# EAGLE design dcdc (EAGLE 6.6.0)
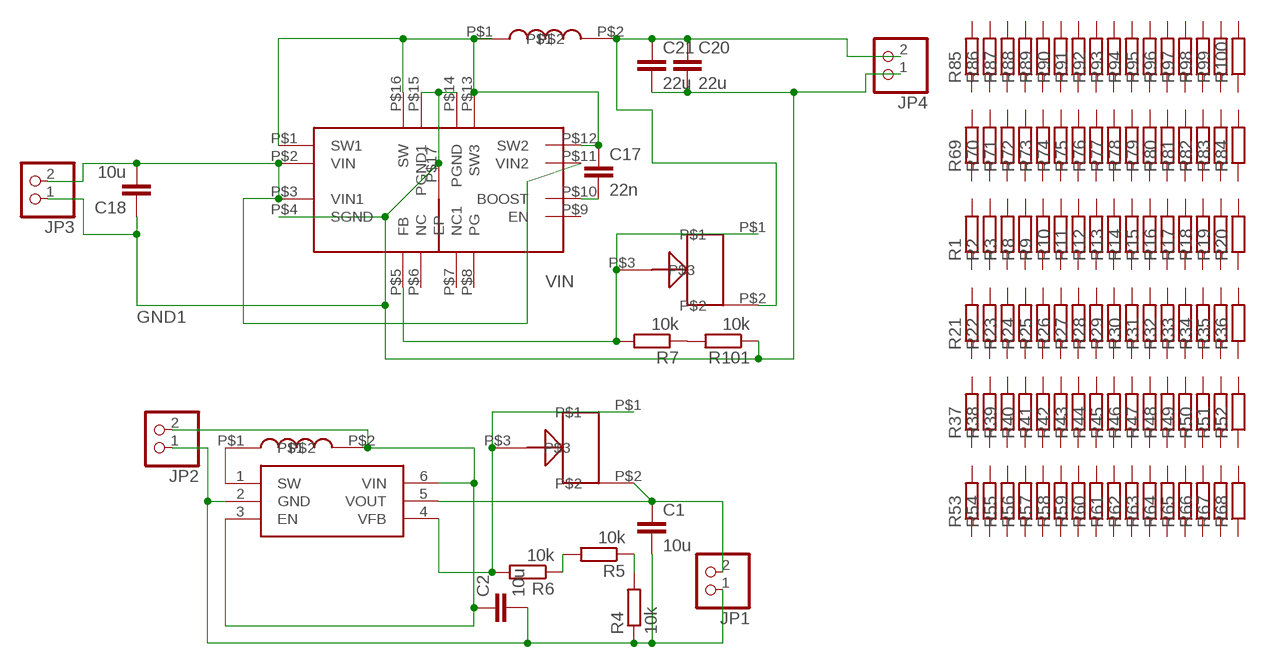
[diagram p0: schematic, sheet 1]

## Parts
C1  10u  C-EUC1206K  [C1206K]
C2  10u  C-EUC1206K  [C1206K]
C17  22n  C-EUC0603  [C0603]
C18  10u  C-EUC1206K  [C1206K]
C20  22u  C-EUC1206K  [C1206K]
C21  22u  C-EUC1206K  [C1206K]
JP1  PINHD-1X2  [1X02]
JP2  PINHD-1X2  [1X02]
JP3  PINHD-1X2  [1X02]
JP4  PINHD-1X2  [1X02]
R1  R-EU_R0402  [R0402]
R2  R-EU_R0402  [R0402]
R3  R-EU_R0402  [R0402]
R4  10k  R-EU_R0603  [R0603]
R5  10k  R-EU_R0603  [R0603]
R6  10k  R-EU_R0603  [R0603]
R7  10k  R-EU_R0603  [R0603]
R8  R-EU_R0402  [R0402]
R9  R-EU_R0402  [R0402]
R10  R-EU_R0402  [R0402]
R11  R-EU_R0402  [R0402]
R12  R-EU_R0402  [R0402]
R13  R-EU_R0402  [R0402]
R14  R-EU_R0402  [R0402]
R15  R-EU_R0402  [R0402]
R16  R-EU_R0402  [R0402]
R17  R-EU_R0402  [R0402]
R18  R-EU_R0402  [R0402]
R19  R-EU_R0402  [R0402]
R20  R-EU_R0402  [R0402]
R21  R-EU_R0402  [R0402]
R22  R-EU_R0402  [R0402]
R23  R-EU_R0402  [R0402]
R24  R-EU_R0402  [R0402]
R25  R-EU_R0402  [R0402]
R26  R-EU_R0402  [R0402]
R27  R-EU_R0402  [R0402]
R28  R-EU_R0402  [R0402]
R29  R-EU_R0402  [R0402]
R30  R-EU_R0402  [R0402]
R31  R-EU_R0402  [R0402]
R32  R-EU_R0402  [R0402]
R33  R-EU_R0402  [R0402]
R34  R-EU_R0402  [R0402]
R35  R-EU_R0402  [R0402]
R36  R-EU_R0402  [R0402]
R37  R-EU_R0603  [R0603]
R38  R-EU_R0603  [R0603]
R39  R-EU_R0603  [R0603]
R40  R-EU_R0603  [R0603]
R41  R-EU_R0603  [R0603]
R42  R-EU_R0603  [R0603]
R43  R-EU_R0603  [R0603]
R44  R-EU_R0603  [R0603]
R45  R-EU_R0603  [R0603]
R46  R-EU_R0603  [R0603]
R47  R-EU_R0603  [R0603]
R48  R-EU_R0603  [R0603]
R49  R-EU_R0603  [R0603]
R50  R-EU_R0603  [R0603]
R51  R-EU_R0603  [R0603]
R52  R-EU_R0603  [R0603]
R53  R-EU_R0603  [R0603]
R54  R-EU_R0603  [R0603]
R55  R-EU_R0603  [R0603]
R56  R-EU_R0603  [R0603]
R57  R-EU_R0603  [R0603]
R58  R-EU_R0603  [R0603]
R59  R-EU_R0603  [R0603]
R60  R-EU_R0603  [R0603]
R61  R-EU_R0603  [R0603]
R62  R-EU_R0603  [R0603]
R63  R-EU_R0603  [R0603]
R64  R-EU_R0603  [R0603]
R65  R-EU_R0603  [R0603]
R66  R-EU_R0603  [R0603]
R67  R-EU_R0603  [R0603]
R68  R-EU_R0603  [R0603]
R69  R-EU_R0402  [R0402]
R70  R-EU_R0402  [R0402]
R71  R-EU_R0402  [R0402]
R72  R-EU_R0402  [R0402]
R73  R-EU_R0402  [R0402]
R74  R-EU_R0402  [R0402]
R75  R-EU_R0402  [R0402]
R76  R-EU_R0402  [R0402]
R77  R-EU_R0402  [R0402]
R78  R-EU_R0402  [R0402]
R79  R-EU_R0402  [R0402]
R80  R-EU_R0402  [R0402]
R81  R-EU_R0402  [R0402]
R82  R-EU_R0402  [R0402]
R83  R-EU_R0402  [R0402]
R84  R-EU_R0402  [R0402]
R85  R-EU_R0402  [R0402]
R86  R-EU_R0402  [R0402]
R87  R-EU_R0402  [R0402]
R88  R-EU_R0402  [R0402]
R89  R-EU_R0402  [R0402]
R90  R-EU_R0402  [R0402]
R91  R-EU_R0402  [R0402]
R92  R-EU_R0402  [R0402]
R93  R-EU_R0402  [R0402]
R94  R-EU_R0402  [R0402]
R95  R-EU_R0402  [R0402]
R96  R-EU_R0402  [R0402]
R97  R-EU_R0402  [R0402]
R98  R-EU_R0402  [R0402]
R99  R-EU_R0402  [R0402]
R100  R-EU_R0402  [R0402]
R101  10k  R-EU_R0603  [R0603]
U$1  TRIMMER3MM  [TRIMMER3MM]
U$2  MCP1640SOT23-6  [SOT23-6L]
U$3  EPL2014  [EPL2014]
U$4  TRIMMER3MM  [TRIMMER3MM]
U$18  NR6028  [NRS6]
U$19  MCP16323  [QFN16]

## Nets
GND: C1.2 C2.2 JP1.1 JP2.1 R4.1 U$2.2(GND)
GND1: C18.1 C20.2 C21.2 JP3.1 JP4.1 R101.1 U$19.P$4(SGND) U$19.P$14(PGND) U$19.P$15(PGND1) U$19.P$17(EP)
N$6: R7.2 U$4.P$1 U$4.P$3 U$19.P$5(FB)
N$7: R4.2 R5.1
N$8: C1.1 JP1.2 U$1.P$2 U$2.5(VOUT)
N$9: U$2.1(SW) U$3.P$1
N$10: R5.2 R6.1
N$11: C2.1 JP2.2 U$2.3(EN) U$2.6(VIN) U$3.P$2
N$12: R7.1 R101.2
N$13: R6.2 U$1.P$1 U$1.P$3 U$2.4(VFB)
N$90: C17.2 U$19.P$10(BOOST)
SW: C17.1 U$18.P$1 U$19.P$1(SW1) U$19.P$12(SW2) U$19.P$13(SW3) U$19.P$16(SW)
VIN: C18.2 JP3.2 U$19.P$2(VIN) U$19.P$3(VIN1) U$19.P$11(VIN2)
VOUT: C20.1 C21.1 JP4.2 U$4.P$2 U$18.P$2
Unconnected: R1.1 R1.2 R2.1 R2.2 R3.1 R3.2 R8.1 R8.2 R9.1 R9.2 R10.1 R10.2 R11.1 R11.2 R12.1 R12.2 R13.1 R13.2 R14.1 R14.2 R15.1 R15.2 R16.1 R16.2 R17.1 R17.2 R18.1 R18.2 R19.1 R19.2 R20.1 R20.2 R21.1 R21.2 R22.1 R22.2 R23.1 R23.2 R24.1 R24.2 R25.1 R25.2 R26.1 R26.2 R27.1 R27.2 R28.1 R28.2 R29.1 R29.2 R30.1 R30.2 R31.1 R31.2 R32.1 R32.2 R33.1 R33.2 R34.1 R34.2 R35.1 R35.2 R36.1 R36.2 R37.1 R37.2 R38.1 R38.2 R39.1 R39.2 R40.1 R40.2 R41.1 R41.2 R42.1 R42.2 R43.1 R43.2 R44.1 R44.2 R45.1 R45.2 R46.1 R46.2 R47.1 R47.2 R48.1 R48.2 R49.1 R49.2 R50.1 R50.2 R51.1 R51.2 R52.1 R52.2 R53.1 R53.2 R54.1 R54.2 R55.1 R55.2 R56.1 R56.2 R57.1 R57.2 R58.1 R58.2 R59.1 R59.2 R60.1 R60.2 R61.1 R61.2 R62.1 R62.2 R63.1 R63.2 R64.1 R64.2 R65.1 R65.2 R66.1 R66.2 R67.1 R67.2 R68.1 R68.2 R69.1 R69.2 R70.1 R70.2 R71.1 R71.2 R72.1 R72.2 R73.1 R73.2 R74.1 R74.2 R75.1 R75.2 R76.1 R76.2 R77.1 R77.2 R78.1 R78.2 R79.1 R79.2 R80.1 R80.2 R81.1 R81.2 R82.1 R82.2 R83.1 R83.2 R84.1 R84.2 R85.1 R85.2 R86.1 R86.2 R87.1 R87.2 R88.1 R88.2 R89.1 R89.2 R90.1 R90.2 R91.1 R91.2 R92.1 R92.2 R93.1 R93.2 R94.1 R94.2 R95.1 R95.2 R96.1 R96.2 R97.1 R97.2 R98.1 R98.2 R99.1 R99.2 R100.1 R100.2 U$19.P$6(NC) U$19.P$7(NC1) U$19.P$8(PG) U$19.P$9(EN)

## Library data of the parts
C1 C2 C17 C18 C20 C21 = rcl:C-EU: CAPACITOR, European symbol
JP1-JP4 = pinhead:PINHD-1X2: PIN HEADER
R1-R101 = rcl:R-EU_: RESISTOR, European symbol
U$1 U$4 = untitled:TRIMMER3MM
U$2 = motiondet:MCP1640
U$3 = dcdcinductors:EPL2014
U$18 = dcdcinductors:NR6028
U$19 = daq:MCP16323

## Board
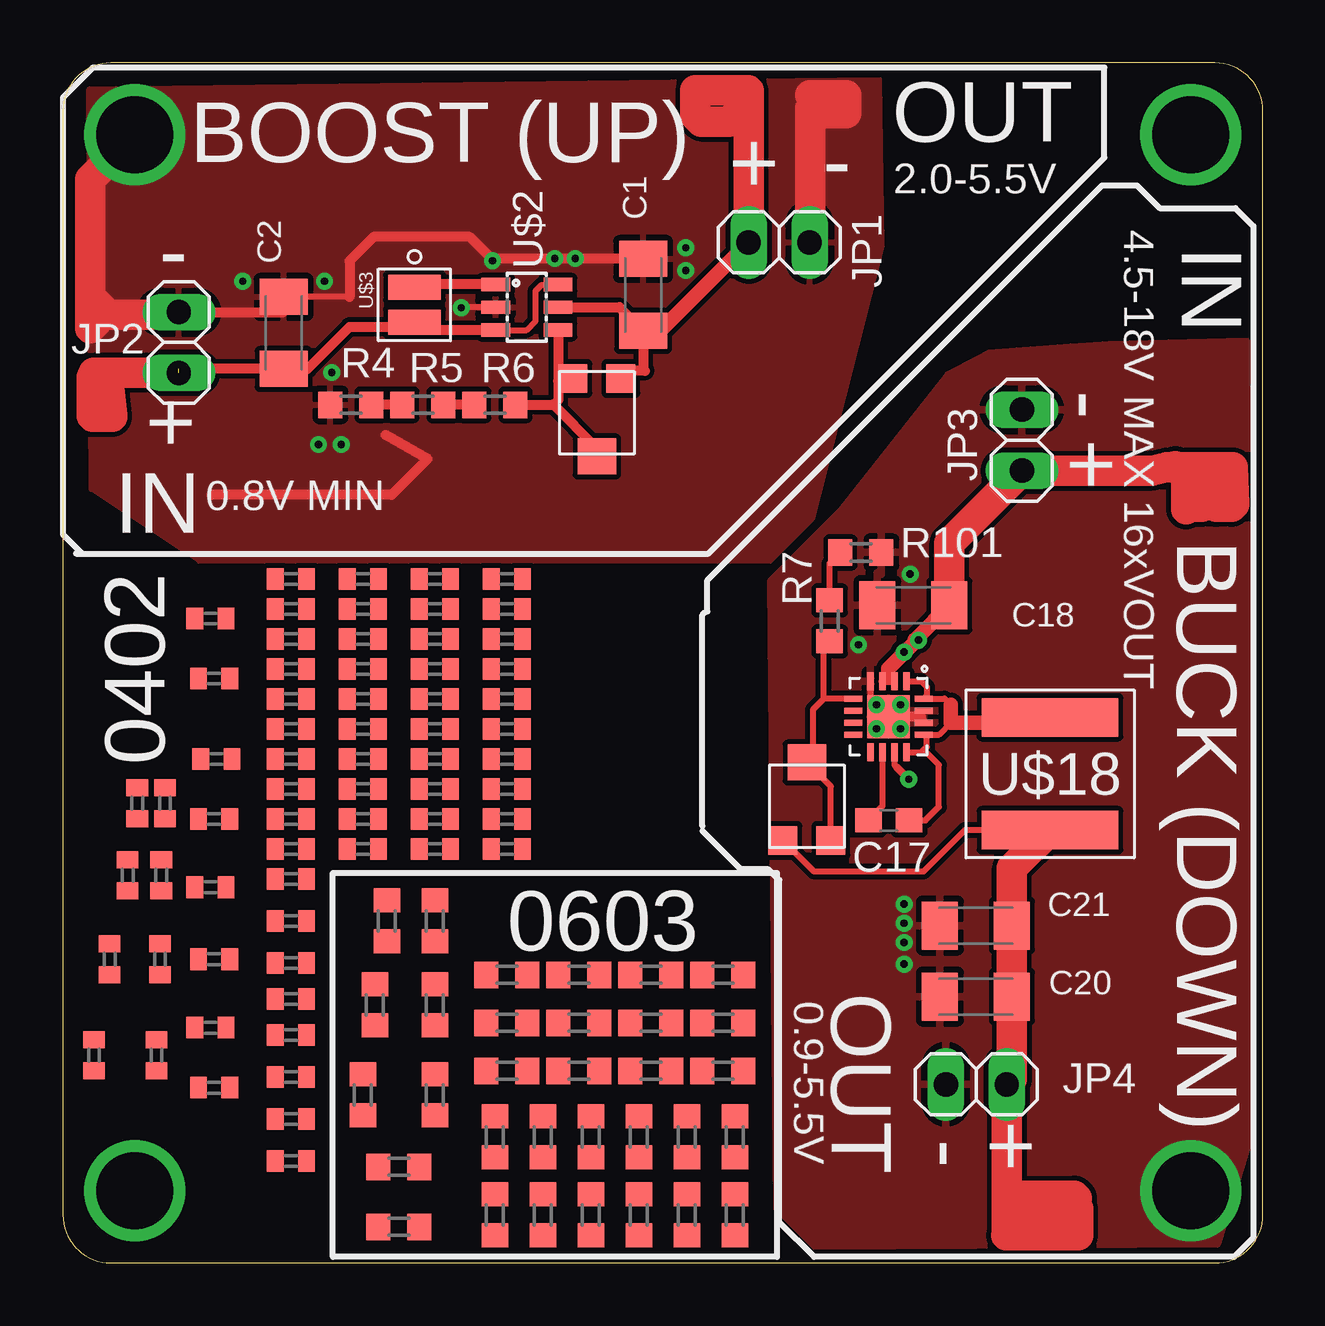
[diagram p1: board, top side]
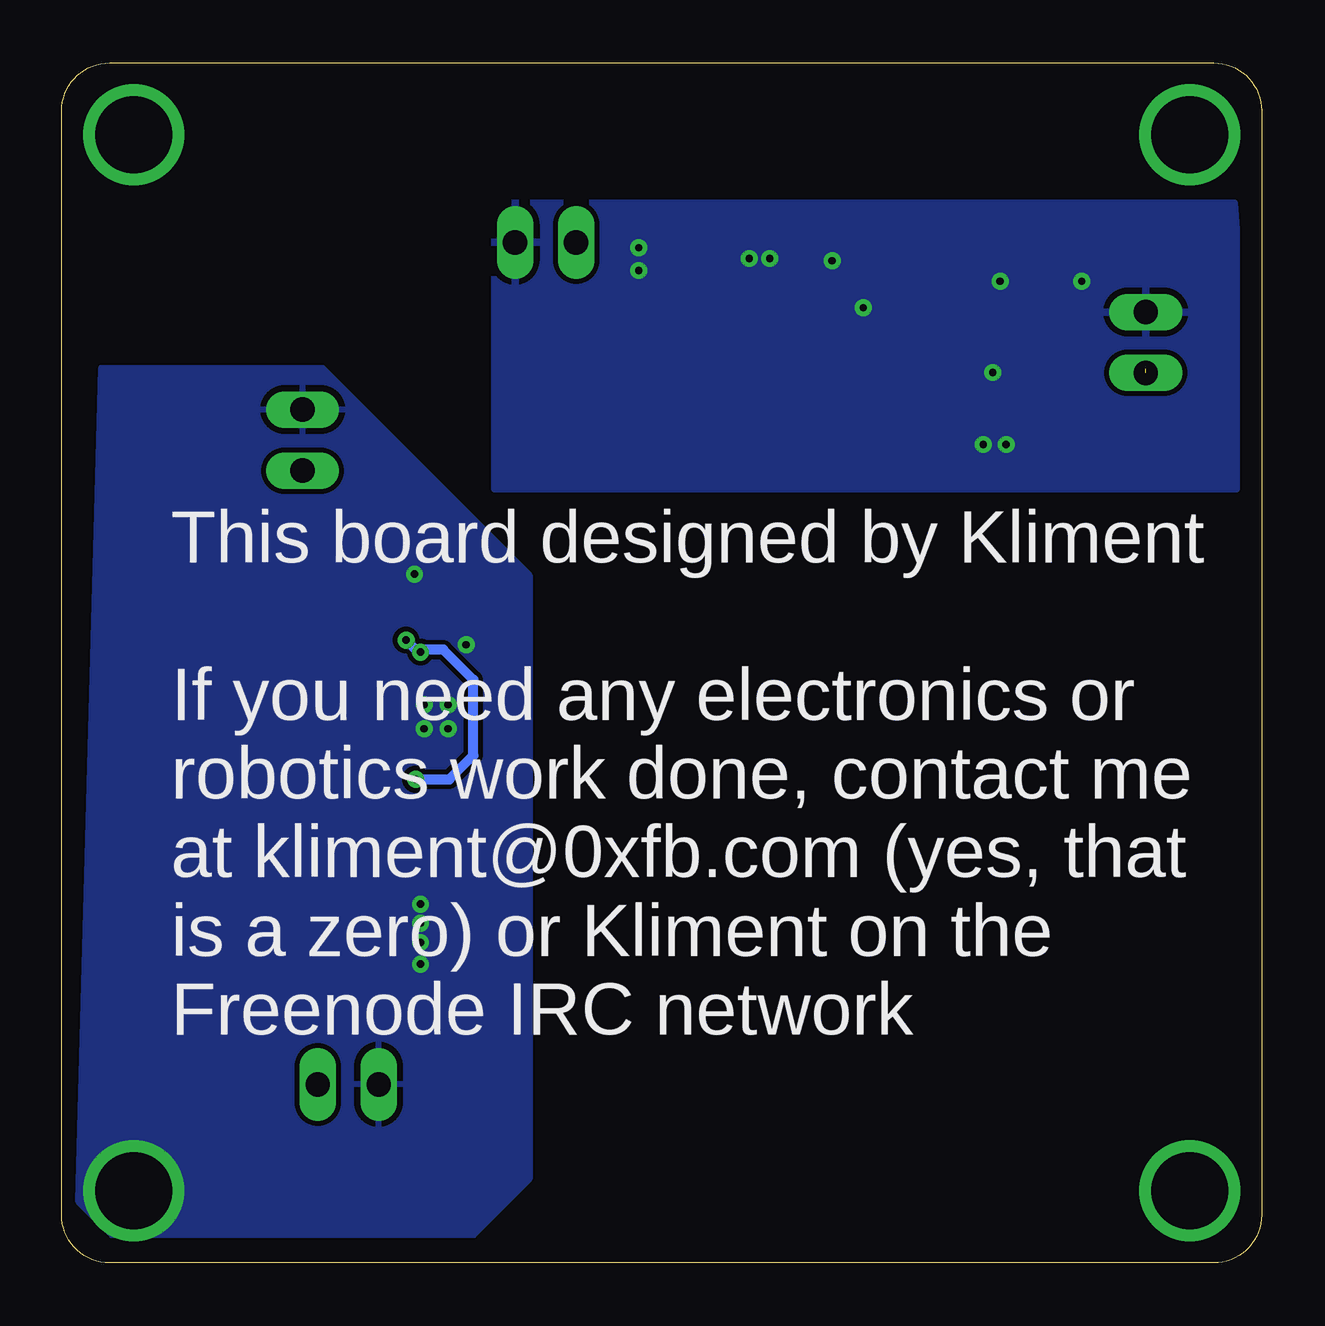
[diagram p2: board, bottom side, seen from below]

Size 50 x 50 mm. Coordinates in mm from the lower left corner, seen from the top.
Outline: 0,48 0,2 arc90 2,0 48,0 arc90 50,2 50,48 arc90 48,50 2,50 arc90 0,48
Copper layers (1*16): Top 0.035mm / dielectric 1.5mm / Bottom 0.035mm
Design rules "default *": minimum track width 10mil, minimum drill 0.3mm, track to track 8mil, track to pad 8mil, pad to pad 8mil, via to via 8mil, smd to smd 0mil, copper to edge 0.5mm, drill to drill 8mil, minimum pad ring 10mil, minimum via ring 8mil, stop-mask expansion 4mil, vias tented up to drill 40mil, thermal gap 10mil

### Footprints (pad centres in the part's own frame; a part is rotated, then mirrored left to right if it is on the bottom)
C1206K = smd 1.5 x 2: 1 -1.5,0; 2 1.5,0
C0603 = smd 1.1 x 1: 1 -0.85,0; 2 0.85,0
1X02 = drill 1.016 long: 1 -1.27,0; 2 1.27,0
R0402 = smd 0.7 x 0.9: 1 -0.65,0; 2 0.65,0
R0603 = smd 1 x 1.1: 1 -0.85,0; 2 0.85,0
TRIMMER3MM = smd 1.2 x 1.2: P$1 1,-1.6; P$2 -1,-1.6 | smd 1.6 x 1.5: P$3 0,1.65
SOT23-6L = smd 0.55 x 1.2: 1 -0.95,-1.3; 2 0,-1.3; 3 0.95,-1.3; 4 0.95,1.3; 5 0,1.3; 6 -0.95,1.3
EPL2014 = smd 1.04 x 2.2: P$1 -0.725,0; P$2 0.725,0
NRS6 = smd 1.6 x 5.7: P$1 -2.35,0; P$2 2.35,0
QFN16 = smd 0.75 x 0.26: P$1 -1.475,0.75; P$2 -1.475,0.25; P$3 -1.475,-0.25; P$4 -1.475,-0.75; P$9 1.475,-0.75; P$10 1.475,-0.25; P$11 1.475,0.25; P$12 1.475,0.75 | smd 0.26 x 0.75: P$5 -0.75,-1.475; P$6 -0.25,-1.475; P$7 0.25,-1.475; P$8 0.75,-1.475; P$13 0.75,1.475; P$14 0.25,1.475; P$15 -0.25,1.475; P$16 -0.75,1.475 | smd 1.78 x 1.78: P$17 0,0

### Placement (x,y rotation side)
C1  24.18,40.33 90 top
C2  9.2,38.75 90 top
C17  34.41,18.44 180 top
C18  35.44,27.4 0 top
C20  38.04,11.09 180 top
C21  38.04,14.05 180 top
JP1  29.84,42.52 180 top
JP2  4.83,38.35 270 top
JP3  39.96,34.28 270 top
JP4  38.06,7.44 0 top
R1  3.1,19.15 90 top
R2  2.7,16.15 90 top
R3  4.05,12.65 90 top
R4  12,35.75 0 top
R5  15,35.75 0 top
R6  18,35.75 0 top
R7  31.95,26.75 270 top
R8  3.9,8.65 90 top
R9  1.3,8.65 90 top
R10  4.25,19.15 90 top
R11  4.1,16.15 90 top
R12  1.95,12.65 90 top
R13  6.15,26.85 0 top
R14  6.3,24.35 0 top
R15  6.4,21 0 top
R16  6.3,18.5 0 top
R17  6.15,15.65 0 top
R18  6.3,12.65 0 top
R19  6.15,9.8 0 top
R20  6.3,7.3 0 top
R21  9.5,28.5 0 top
R22  9.5,26 0 top
R23  9.5,24.75 0 top
R24  9.5,27.25 0 top
R25  9.5,22.25 0 top
R26  9.5,23.5 0 top
R27  9.5,12.5 0 top
R28  9.5,17.25 0 top
R29  9.5,21 0 top
R30  9.5,11 0 top
R31  9.5,16 0 top
R32  9.5,19.75 0 top
R33  9.5,9.5 0 top
R34  9.5,14.25 0 top
R35  9.5,18.5 0 top
R36  9.5,7.75 0 top
R37  28,2 90 top
R38  20,5.25 90 top
R39  18.5,8 0 top
R40  26,2 90 top
R41  22,5.25 90 top
R42  21.5,8 0 top
R43  24,2 90 top
R44  24,5.25 90 top
R45  24.5,8 0 top
R46  22,2 90 top
R47  26,5.25 90 top
R48  18.5,10 0 top
R49  20,2 90 top
R50  28,5.25 90 top
R51  27.5,8 0 top
R52  18,2 90 top
R53  14,1.5 0 top
R54  15.5,14.25 90 top
R55  24.5,12 0 top
R56  14,4 0 top
R57  13.5,14.25 90 top
R58  27.5,12 0 top
R59  18.5,12 0 top
R60  18,5.25 90 top
R61  27.5,10 0 top
R62  21.5,12 0 top
R63  13,10.75 90 top
R64  24.5,10 0 top
R65  12.5,7 90 top
R66  15.5,10.75 90 top
R67  21.5,10 0 top
R68  15.5,7 90 top
R69  12.5,28.5 0 top
R70  12.5,27.25 0 top
R71  12.5,26 0 top
R72  15.5,27.25 0 top
R73  12.5,18.5 0 top
R74  12.5,24.75 0 top
R75  15.5,26 0 top
R76  15.5,28.5 0 top
R77  12.5,23.5 0 top
R78  15.5,24.75 0 top
R79  12.5,17.25 0 top
R80  12.5,22.25 0 top
R81  15.5,23.5 0 top
R82  12.5,19.75 0 top
R83  12.5,21 0 top
R84  15.5,22.25 0 top
R85  9.5,6 0 top
R86  9.5,4.25 0 top
R87  18.5,21 0 top
R88  18.5,18.5 0 top
R89  18.5,19.75 0 top
R90  18.5,22.25 0 top
R91  18.5,23.5 0 top
R92  18.5,24.75 0 top
R93  18.5,28.5 0 top
R94  18.5,27.25 0 top
R95  18.5,26 0 top
R96  15.5,17.25 0 top
R97  15.5,18.5 0 top
R98  15.5,19.75 0 top
R99  15.5,21 0 top
R100  18.5,17.25 0 top
R101  33.25,29.6 180 top
U$1  22.25,35.25 180 top
U$2  19.33,39.82 270 top
U$3  14.65,39.92 270 top
U$4  31,19.2 0 top
U$18  41.13,20.38 270 top
U$19  34.4,22.76 270 top

### Tracks (layer width: path | path; a pad name or v marks a point on that pad's centre or on a via)
GND  (via drill 0.3, 3.2)
  Top 0.254: U$2.2 16.88,39.82 | 11.95,40.25 C2.2
  Top 0.406: C2.2 9.2,39.62 JP2.1 4.71,39.5 3.7,39.5 | C1.2 17.87,41.83 16.95,42.75 12.95,42.75 11.95,41.75 11.95,40.25 | 13.45,34.5 15.2,33.5 13.7,32 6.2,32
  Top 1.27: 31.15,48.65 32.65,48.65 32.65,47.9 31.15,47.9 | 31.15,47.9 31.15,48.1 | 31.15,47.9 31.15,42.65 | 3.7,39.5 1.9,39.5 1.4,40 1.4,39.2 1.15,38.95 1.15,45.15 v3,47
  other vias: 10.65,34.1 11.6,34.1 16.6,39.8 17.9,41.75 20.5,41.85 21.35,41.85 7.5,40.9 10.9,40.9 11.2,37.1 25.95,41.35 25.95,42.3
  pour Top (rank 3): 1.1,48.9 34,49.3 34.1,42.35 31.2,31 29.45,29.25 5.7,29.25 1.2,32.25
  pour Bottom (rank 2): 1.15,44.15 31.95,44.15 31.95,32.25 1.05,32.25 1.05,43.05
GND1  (via drill 0.3, 3.2)
  Top 0.254: U$19.P$14 35.88,22.62 35.75,22.75 | U$19.P$4 33.65,23.51 U$19.P$17
  Top 0.406: 35.75,22.75 U$19.P$17
  other vias: 33.9,23.25 34.9,23.25 34.9,22.25 33.9,22.25 33.15,25.75 35.3,28.7 35.05,14.95 35.05,14.15 35.05,13.35 35.05,12.45 47,3
  pour Top (rank 2): 42,38.15 43.6,38.25 49.3,38.4 49.5,5.35 48.1,0.8 31.35,0.7 29.75,2.3 29.5,28.4 32.35,31.25 36.9,37 38.6,37.9
  pour Bottom (rank 2): 48.35,37.3 39.15,37.3 30.5,28.65 30.5,3.5 32.85,1.15 47.9,1.15 49.3,2.55
N$2  (via drill 3.2)
  other vias: 3,3
N$5  (via drill 3.2)
  other vias: 47,47
N$6
  Top 0.254: U$4.P$1 32,19.85 U$4.P$3 31.25,21.1 31.25,23.05 31.71,23.51 | U$19.P$5 31.71,23.51 | 31.71,23.51 31.71,25.66 R7.2
N$7
  Top 0.406: R5.1 R4.2
N$8
  Top 0.406: U$2.5 23.19,39.82 C1.1 24.18,37.24 24.25,37.17 23.57,37.17 U$1.P$2
  Top 0.61: C1.1 24.88,38.83 JP1.2
  Top 1.27: JP1.2 28.57,48.83 28.55,48.85 26.35,48.85 26.35,47.8 26.6,47.55 27.75,47.55 28.05,47.85
N$9
  Top 0.406: U$2.1 15.43,40.77 15.45,40.75 15.45,40.65 U$3.P$1
N$10
  Top 0.406: R6.1 R5.2
N$11  (1 unrouted)
  Top 0.254: U$2.3 19.32,38.87 19.7,39.25 19.7,40.5 19.95,40.75 20.61,40.75
  Top 0.406: C2.1 4.83,37.25 | C2.1 10.2,37.25 11.95,39 15.15,39 | U$2.3 15.25,38.87 | 15.25,38.87 14.8,38.87 | 20.61,40.75 U$2.6 | 8.77,36.82 C2.1 | 15.15,39 U$3.P$2 | 15.15,39 15.25,39 15.25,38.87
  Top 1.27: JP2.2 1.28,37.08 1.2,36.9 1.2,35.3 1.25,35.25 2.05,35.25 2.05,35.3 1.9,36.8 1.85,36.85
N$12
  Top 0.254: R7.1 31.95,29.15 R101.2
N$13
  Top 0.406: U$2.4 20.63,36.75 | 20.63,36.75 20.63,35.93 20.45,35.75 | R6.2 20.45,35.75 | U$1.P$3 22.25,33.95 20.45,35.75 | U$1.P$1 20.73,36.85 20.63,36.75
N$90
  Top 0.254: U$19.P$10 34.15,19.03 C17.2
SW
  Top 0.254: 37,22.5 36.51,22.01 U$19.P$13 36,21.89 36,21.5 35.88,21.38 | U$19.P$12 35.78,21.29 35.88,21.38 | U$19.P$1 35.77,24.23 36,24 36,23.64 U$19.P$16 36.74,23.51 37,23.25 | C17.1 35.94,18.44 36.5,19 36.5,20.75 35.88,21.38
  Top 0.61: U$18.P$1 40.9,22.5 37,22.5 37,23.25
VIN  (via drill 0.3)
  Top 0.254: U$19.P$2 34.62,24.23 34.4,24.45 | U$19.P$11 34.65,20.75 34.75,20.65
  Top 0.305: U$19.P$3 U$19.P$2 | 34.75,20.65 v35.25,20.15
  Top 0.406: v35.05,25.45 35.05,25.5 35.1,25.55 35.25,25.55 v35.65,25.95 35.57,26.03
  Top 0.61: 34.4,24.45 34.4,24.75 35.5,25.85 35.5,25.96 35.57,26.03 C18.2
  Top 1.27: 46.35,33.2 46.8,32.75 46.8,31.4 46.9,31.5 47.45,31.5 47.3,31.65 47.3,33.1 47.5,32.9 47.9,32.9 48.05,32.75 48.05,31.5 48.7,31.5 48.8,31.6 48.75,33.15 46,33.15 45.36,33.01 JP3.2 36.94,29.99 C18.2
  Bottom 0.406: v35.25,20.15 33.85,20.15 32.85,21.15 32.85,24.3 34.1,25.55 35.25,25.55 v35.65,25.95
VOUT
  Top 0.254: U$18.P$2 37.58,18.03 35.85,16.3 31.3,16.3 U$4.P$2
  Top 0.61: 39.16,5.96 JP4.2
  Top 1.27: U$18.P$2 39.54,16.44 C21.1 C20.1 39.54,7.65 JP4.2 39.33,1.18 39.3,1.15 42.3,1.15 42.3,2.25 42.25,2.3 40.25,2.3 40.15,2.2 40.15,2.65 40,2.8 42.15,2.8 42.25,2.7

### Text on the board
tPlace: OUT | BOOST (UP) | + | - | 2.0-5.5V | 4.5-18V | IN | - | MAX 16xVOUT | - | + | + | 0.8V MIN | IN | BUCK (DOWN) | 0402 | 0603 | 0.9-5.5V | OUT | - | +
bPlace: This board designed by Kliment / / If you need any electronics or / robotics work done, contact me / at kliment@0xfb.com (yes, that / is a zero) or Kliment on the / Freenode IRC network
tNames: U$18